# Altium schematic sheet Reefing-Barometer.SchDoc: Reefing System
size A4; DocumentNumber: Subtitle; Revision: V1.0; SheetNumber: 9; SheetTotal: 13; Author: Luca Jost; Subtitle: Barometer
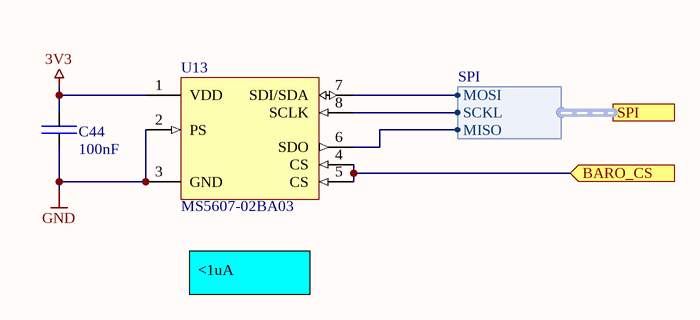
[diagram p0: Reefing-Barometer.SchDoc]

## Parts
C44  100nF  [SMD Keramikkondensator 0402]
U13  MS5607-02BA03  [SMD IC BARO MS5607]

## Ports
BARO_CS (in), SPI (harness SPI)

## Harnesses
SPI: SCKL, MOSI, MISO

## Nets
3V3: C44.2 U13.1(VDD)
GND: C44.1 U13.2(PS) U13.3(GND)
BARO_CS: U13.4(CS) U13.5(CS) ; port BARO_CS
NetU13_6: U13.6(SDO) ; port SPI.MISO
NetU13_7: U13.7(SDI/SDA) ; port SPI.MOSI
NetU13_8: U13.8(SCLK) ; port SPI.SCKL

## Notes on the sheet
- <1uA
- Title
- Author:
- Subtitle
- Date:
- Rev:
- File:
- Sheet
- of

## Library data of the parts
C44 = E6 - 100nF: SMD Ceramic Capacitor E6; Unit Price: 0.01; Number: -; Supplier: -; JLC: C307331
U13 = MS5607-02BA03: Barometric Pressure Sensor, with stainless / steel cap; ComponentLink1Description: Datasheet; ComponentLink1URL: https://www.te.com/commerce/DocumentDelivery/DDEController?Action=srchrtrv&DocNm=MS5607-02BA03&DocType=Data+Sheet&DocLang=English; Digikey: 223-1198-1-ND